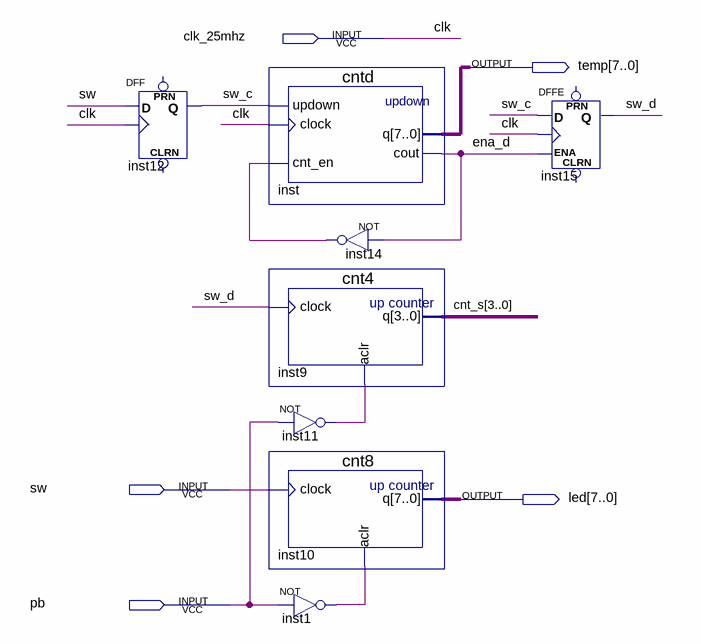
[diagram p0: schematic sheet]
// Quartus schematic lab_cb_fixed.bdf as structural Verilog: 8 symbols, 5 pins
module lab_cb_fixed (
  input  clk_25mhz,
  input  sw,
  input  pb,
  output [7:0] temp,
  output [7:0] led
);

  wire ena_d, inst1_out, inst11_out, inst14_out, sw_c, sw_d;
  wire [3:0] cnt_s;

  DFF inst12 (.CLK(clk_25mhz), .D(sw), .Q(sw_c));  // open: CLRN, PRN
  cntd inst (.updown(sw_c), .clock(clk_25mhz), .cnt_en(inst14_out), .cout(ena_d), .q(temp));
  cnt4 inst9 (.clock(sw_d), .aclr(inst11_out), .q(cnt_s));
  not inst11 (inst11_out, pb);
  cnt8 inst10 (.clock(sw), .aclr(inst1_out), .q(led));
  not inst1 (inst1_out, pb);
  not inst14 (inst14_out, ena_d);
  DFFE inst15 (.D(sw_c), .CLK(clk_25mhz), .ENA(ena_d), .Q(sw_d));  // open: PRN, CLRN

  // Other names for the same wires on the sheet: clk = clk_25mhz
endmodule
